# Altium schematic sheet Схема LoRa и RFID Velvet Controller.SchDoc
size A3; SheetNumber: 3; SheetTotal: 6
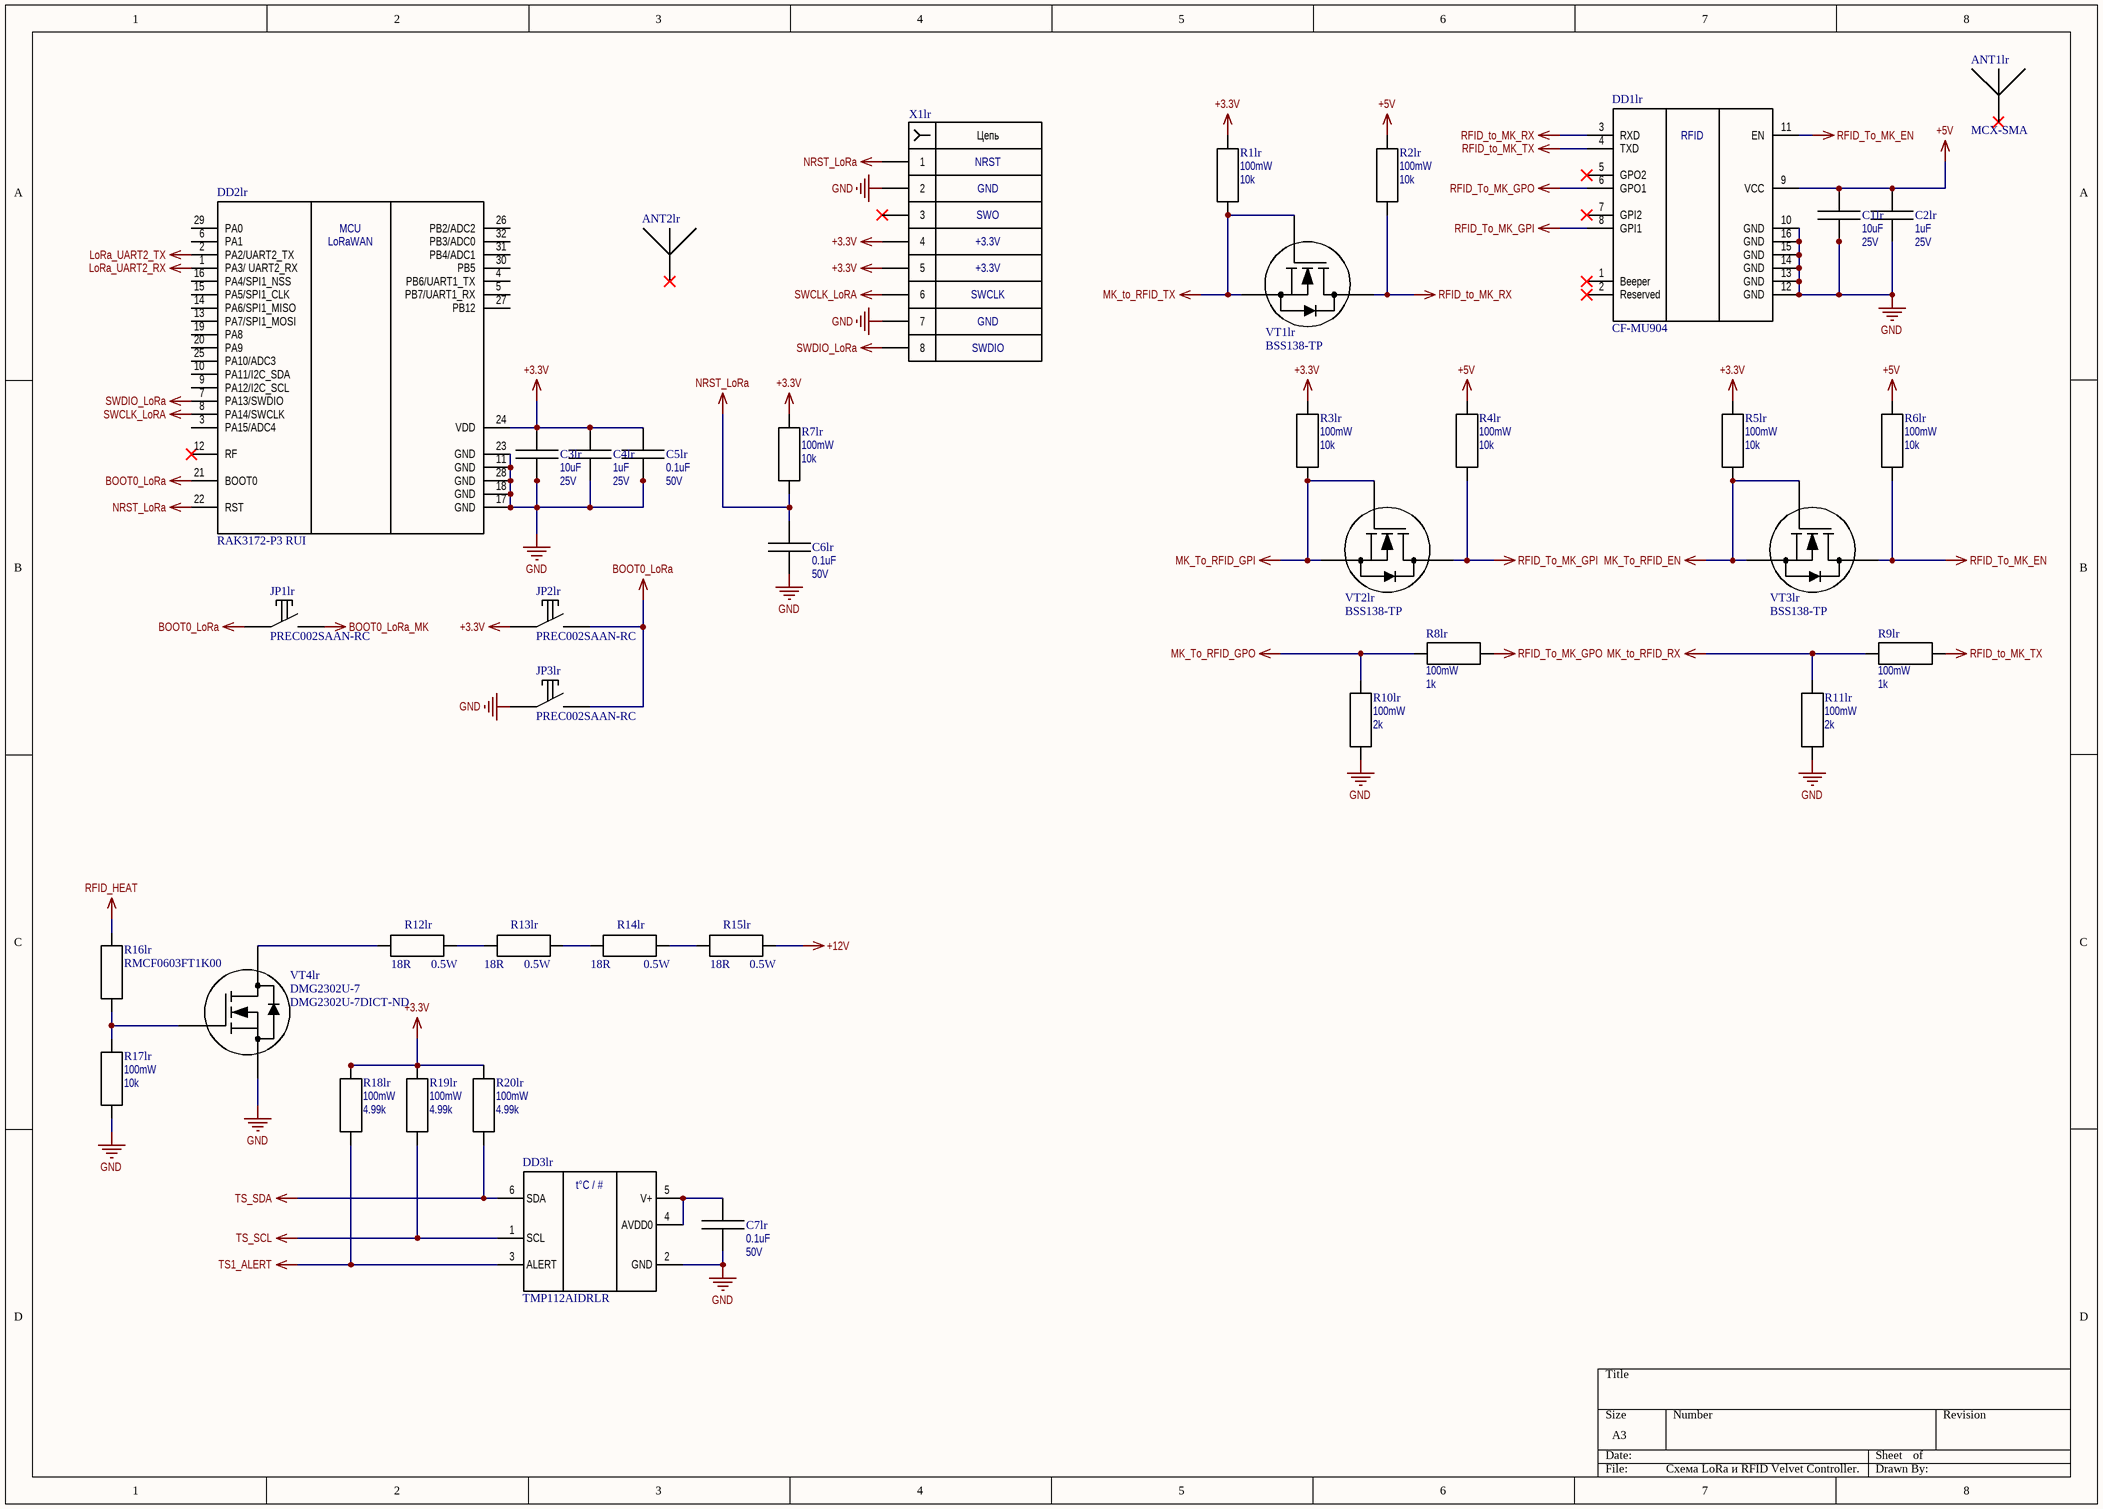
[diagram p0: Схема LoRa и RFID Velvet Controller.SchDoc]

## Parts
ANT1lr  MCX-SMA  (mechanical)
ANT2lr  CA-DKCA0-152L0-AJI0-O  (value not drawn)  (mechanical)
C1lr  Capacitance: 10uF  Rated Voltage: 25V  [CAP 1206 IPC MAX]  (hidden comment: CL31B106KAHNNNE)
C2lr  Capacitance: 1uF  Rated Voltage: 25V  [CAP 0603 IPC MAX]  (hidden comment: TMK107BJ105KA-T)
C3lr  Capacitance: 10uF  Rated Voltage: 25V  [CAP 1206 IPC MAX]  (hidden comment: CL31B106KAHNNNE)
C4lr  Capacitance: 1uF  Rated Voltage: 25V  [CAP 0603 IPC MAX]  (hidden comment: TMK107BJ105KA-T)
C5lr  Capacitance: 0.1uF  Rated Voltage: 50V  [CAP 0603 IPC MAX]  (hidden comment: GCM188R71H104KA57D)
C6lr  Capacitance: 0.1uF  Rated Voltage: 50V  [CAP 0603 IPC MAX]  (hidden comment: GCM188R71H104KA57D)
C7lr  Capacitance: 0.1uF  Rated Voltage: 50V  [CAP 0603 IPC MAX]  (hidden comment: GCM188R71H104KA57D)
DD1lr  CF-MU904  [CF-MU904]
DD2lr  RAK3172-P3 RUI  [RAK3172]
DD3lr  TMP112AIDRLR  [SOT-563]
JP1lr  PREC002SAAN-RC  [2P TH 2.54mm]
JP2lr  PREC002SAAN-RC  [2P TH 2.54mm]
JP3lr  PREC002SAAN-RC  [2P TH 2.54mm]
R1lr  Power Rated: 100mW  Resistance: 10k  [RES 0603 IPC MAX]  (hidden comment: RMCF0603JT10K0)
R2lr  Power Rated: 100mW  Resistance: 10k  [RES 0603 IPC MAX]  (hidden comment: RMCF0603JT10K0)
R3lr  Power Rated: 100mW  Resistance: 10k  [RES 0603 IPC MAX]  (hidden comment: RMCF0603JT10K0)
R4lr  Power Rated: 100mW  Resistance: 10k  [RES 0603 IPC MAX]  (hidden comment: RMCF0603JT10K0)
R5lr  Power Rated: 100mW  Resistance: 10k  [RES 0603 IPC MAX]  (hidden comment: RMCF0603JT10K0)
R6lr  Power Rated: 100mW  Resistance: 10k  [RES 0603 IPC MAX]  (hidden comment: RMCF0603JT10K0)
R7lr  Power Rated: 100mW  Resistance: 10k  [RES 0603 IPC MAX]  (hidden comment: RMCF0603JT10K0)
R8lr  Rated Power: 100mW  Resistance: 1k  [RES 0603 IPC MAX]  (hidden comment: RMCF0603FT1K00)
R9lr  Rated Power: 100mW  Resistance: 1k  [RES 0603 IPC MAX]  (hidden comment: RMCF0603FT1K00)
R10lr  Rated Power: 100mW  Resistance: 2k  [RES 0603 IPC MAX]  (hidden comment: RMCF0603FT2K00)
R11lr  Rated Power: 100mW  Resistance: 2k  [RES 0603 IPC MAX]  (hidden comment: RMCF0603FT2K00)
R12lr  Resistance: 18R  Rated Power: 0.5W  [RES 1210]  (hidden comment: RMCF1210JT18R0)
R13lr  Resistance: 18R  Rated Power: 0.5W  [RES 1210]  (hidden comment: RMCF1210JT18R0)
R14lr  Resistance: 18R  Rated Power: 0.5W  [RES 1210]  (hidden comment: RMCF1210JT18R0)
R15lr  Resistance: 18R  Rated Power: 0.5W  [RES 1210]  (hidden comment: RMCF1210JT18R0)
R16lr  RMCF0603FT1K00  [RES 0603 IPC MAX]
R17lr  Power Rated: 100mW  Resistance: 10k  [RES 0603 IPC MAX]  (hidden comment: RMCF0603JT10K0)
R18lr  Rated Power: 100mW  Resistance: 4.99k  [RES 0603 IPC MAX]  (hidden comment: RC0603FR-074K99L)
R19lr  Rated Power: 100mW  Resistance: 4.99k  [RES 0603 IPC MAX]  (hidden comment: RC0603FR-074K99L)
R20lr  Rated Power: 100mW  Resistance: 4.99k  [RES 0603 IPC MAX]  (hidden comment: RC0603FR-074K99L)
VT1lr  BSS138-TP  [SOT-23-3]
VT2lr  BSS138-TP  [SOT-23-3]
VT3lr  BSS138-TP  [SOT-23-3]
VT4lr  DMG2302U-7  Supplier Part Number 1: DMG2302U-7DICT-ND  [SOT-23-3]
X1lr  TSW-104-07-F-D  [HEADER 2.54mm 2ROW 8PIN]  (value not drawn)

## Nets
+3.3V: C3lr.1 C4lr.1 C5lr.1 DD2lr.24(VDD) JP2lr.1 R1lr.2 R3lr.2 R5lr.2 R7lr.2 R18lr.2 R19lr.2 R20lr.2 X1lr.4 X1lr.5
+5V: C1lr.1 C2lr.1 DD1lr.9(VCC) R2lr.2 R4lr.2 R6lr.2
+12V: R15lr.2
BOOT0_LoRa: DD2lr.21(BOOT0) JP1lr.1 JP2lr.2 JP3lr.2
BOOT0_LoRa_MK: JP1lr.2
GND: C1lr.2 C2lr.2 C3lr.2 C4lr.2 C5lr.2 C6lr.2 C7lr.2 DD1lr.10(GND) DD1lr.12(GND) DD1lr.13(GND) DD1lr.14(GND) DD1lr.15(GND) DD1lr.16(GND) DD2lr.11(GND) DD2lr.17(GND) DD2lr.18(GND) DD2lr.23(GND) DD2lr.28(GND) DD3lr.2(GND) JP3lr.1 R10lr.1 R11lr.1 R17lr.1 VT4lr.2(S) X1lr.2 X1lr.7
LoRa_UART2_RX: DD2lr.1(PA3/_UART2_RX)
LoRa_UART2_TX: DD2lr.2(PA2/UART2_TX)
MK_To_RFID_EN: R5lr.1 VT3lr.1(G) VT3lr.2(S)
MK_To_RFID_GPI: R3lr.1 VT2lr.1(G) VT2lr.2(S)
MK_To_RFID_GPO: R8lr.1 R10lr.2
MK_to_RFID_RX: R9lr.1 R11lr.2
MK_to_RFID_TX: R1lr.1 VT1lr.1(G) VT1lr.2(S)
NRST_LoRa: C6lr.1 DD2lr.22(RST) R7lr.1 X1lr.1
RFID_HEAT: R16lr.2
RFID_To_MK_EN: DD1lr.11(EN) R6lr.1 VT3lr.3(D)
RFID_To_MK_GPI: DD1lr.8(GPI1) R4lr.1 VT2lr.3(D)
RFID_To_MK_GPO: DD1lr.6(GPO1) R8lr.2
RFID_to_MK_RX: DD1lr.3(RXD) R2lr.1 VT1lr.3(D)
RFID_to_MK_TX: DD1lr.4(TXD) R9lr.2
SWCLK_LoRA: DD2lr.8(PA14/SWCLK) X1lr.6
SWDIO_LoRa: DD2lr.7(PA13/SWDIO) X1lr.8
TS1_ALERT: DD3lr.3(ALERT) R18lr.1
TS_SCL: DD3lr.1(SCL) R19lr.1
TS_SDA: DD3lr.6(SDA) R20lr.1
NetC7lr_1: C7lr.1 DD3lr.4(AVDD0) DD3lr.5(V+)
NetR12lr_1: R12lr.1 VT4lr.3(D)
NetR12lr_2: R12lr.2 R13lr.1
NetR13lr_2: R13lr.2 R14lr.1
NetR14lr_2: R14lr.2 R15lr.1
NetR16lr_1: R16lr.1 R17lr.2 VT4lr.1(G)

Not connected (* = marked no-connect by the designer): ANT1lr 1*; ANT2lr 1*; DD1lr 1(Beeper)* 2(Reserved)* 5(GPO2)* 7(GPI2)*; DD2lr 3(PA15/ADC4) 4(PB6/UART1_TX) 5(PB7/UART1_RX) 6(PA1) 9(PA12/I2C_SCL) 10(PA11/I2C_SDA) 12(RF)* 13(PA7/SPI1_MOSI) 14(PA6/SPI1_MISO) 15(PA5/SPI1_CLK) 16(PA4/SPI1_NSS) 19(PA8) 20(PA9) 25(PA10/ADC3) 26(PB2/ADC2) 27(PB12) 29(PA0) 30(PB5) 31(PB4/ADC1) 32(PB3/ADC0); X1lr 3*

## Notes on the sheet
- NRST
- SWO
- GND
- +3.3V
- SWCLK
- SWDIO
- (in symbol CF-MU904) RFID
- (in symbol RAK3172-P3 RUI) MCU
- (in symbol TMP112AIDRLR) t°C / #
- (in symbol TSW-104-07-F-D) Цепь

## Library data of the parts
ANT1lr = MCX-SMA: MCX-Male to SMA RF 15cm connector; Manufacturer 1: DexMRtiC; Style: N-MCX Cable; 1st Contact Gender: Female; 1st Connector Mounting Type: Panel Mount; 2nd Connector: MCX Male Plug Right Angle; 2nd Contact Gender: Male; 2nd Connector Mounting Type: Free Hanging (In-Line); Frequency - Max: 6 GHz; Manufacturer Part Number 1: -; 1st Connector: SMA; Length: 152.00mm; ComponentLink1Description: Aliexpress; ComponentLink1URL: https://aliexpress.ru/item/32231629780.html?algo_pvid=null&algo_expid=null&spm=a2g2w.productlist.search_results.6.4f564aa6TSsm48&sku_id=12000026772307438
ANT2lr = CA-DKCA0-152L0-AJI0-O: WATERPROOF SMA TO IPEX FOR 1.13; Manufacturer 1: Adam Tech; Style: U.FL (UMCC), IPEX MHF1 to SMA; 1st Connector: SMA Jack; 1st Contact Gender: Female; 1st Connector Mounting Type: Panel Mount; 1st Connector Mounting Feature: Bulkhead - Front Side Nut; 2nd Connector: U.FL (UMCC), IPEX MHF1 Plug, Right Angle; 2nd Connector Mounting Type: Free Hanging (In-Line); Frequency - Max: 6 GHz; Manufacturer Part Number 1: CA-DKCA0-152L0-AJI0-O; 2nd Contact Gender: Female; 2nd Connector Mounting Feature: *; Length: 152.00mm
C1lr C3lr = CL31B106KAHNNNE: CAP SMD CER 10UF 25V X7R 1206; Manufacturer 1: Samsung Electro-Mechanics; Tolerance: 10%; Type: Multilayer Ceramic; Manufacturer Part Number 1: CL31B106KAHNNNE; Min Operating Temperature: -55°C; Max Operating Temperature: 125°C; Mounting: SM; Package: 1206; Supplier 1: Digi-Key; Supplier Part Number 1: 1276-1804-1-ND
C2lr C4lr = TMK107BJ105KA-T: CAP SMD CER 1UF 25V X5R 0603; Manufacturer 1: Taiyo Yuden; Tolerance: 10%; Type: Multilayer Ceramic; Manufacturer Part Number 1: TMK107BJ105KA-T; Min Operating Temperature: -55°C; Max Operating Temperature: 85°C; Mounting: SM; Package: 0603; Supplier 1: Digi-Key; Supplier Part Number 1: 587-1248-1-ND
C5lr C6lr C7lr = GCM188R71H104KA57D: CAP SMD CER 0.1UF 50V X7R 0603; Manufacturer 1: Murata Electronics; Tolerance: 10%; Type: Multilayer Ceramic; Manufacturer Part Number 1: GCM188R71H104KA57D; Min Operating Temperature: -55°C; Max Operating Temperature: 125°C; Mounting: SM; Package: 0603; Supplier 1: Digi-Key; Supplier Part Number 1: 490-4779-1-ND
DD1lr = CF-MU904: UHF RFID Reader Module; Manufacturer 1: ChaFon; Frequency Band 1: 902~928MHz; Frequency Band 2: 865~868MHz; Effective Range: 15m; Tag Buffer Size 1: 370PCS@Max.128bitsEPC; Tag Buffer Size 2: 120PCS@Max.496bitsEPC; Min Supply Voltage: 3.5V; Max Supply Voltage: 5V; RSSI: Yes; Interface: UART; Max Supply Current: 360mA; Manufacturer Part Number 1: CF-MU904; Package: *
DD2lr = RAK3172-P3 RUI: MODULE FOR LORAWAN RAK3172; Manufacturer 1: RAKwireless Technology Limited; Function: Transceiver; Frequency: 433MHz, 470MHz, 864MHz, 865MHz, 868MHz, 915MHz, 920MHz, 923MHz; Min Supply Voltage: 2V; Max Supply Voltage: 3.6V; Max Supply Current: 100mA; Manufacturer Part Number 1: RAK3172-P3 RUI; Min Operating Temperature: -40°C; Max Operating Temperature: 85°C; RF Type: LoRaWAN; Package: 32-SMD Module
DD3lr = TMP112AIDRLR: SOT-563 TEMPERATURE SENSORS ROHS; Manufacturer 1: UMW; Max Accuracy: ±0.1°C; Min Accuracy: ±1°C; Resolution: 12b; Interface: I²C/SMBus; Manufacturer Part Number 1: TMP112AIDRLR; Max Operating Temperature: 150°C; Min Operating Temperature: -55°C; Mounting Type: SM; Package: SOT-563; Supplier 1: Digi-Key; Supplier Part Number 1: 296-38578-1-ND
JP1lr JP2lr JP3lr = PREC002SAAN-RC: CONN HEADER VERT 2POS 2.54MM; Manufacturer 1: Sullins Connector Solutions; Manufacturer Part Number 1: PREC002SAAN-RC; Number of Pins: 2; Pitch: 2.54mm
R1lr R2lr R3lr R4lr R5lr R6lr R7lr R17lr = RMCF0603JT10K0: RES SMD 10K OHM 5% 1/10W 0603; Manufacturer 1: Stackpole Electronics Inc; Voltage Rated: 75V; Manufacturer Part Number 1: RMCF0603JT10K0; Min Operating Temperature: -55°C; Max Operating Temperature: 155°C; Tolerance: 5%; Package: 0603; Ratings: AEC-Q200; Supplier 1: Digi-Key; Supplier Part Number 1: RMCF0603JT10K0CT-ND
R8lr R9lr = RMCF0603FT1K00: RES SMD 1K OHM 1% 1/10W 0603; Manufacturer 1: Stackpole Electronics Inc; Rated Voltage: 75V; Qualification: AEC-Q200; Manufacturer Part Number 1: RMCF0603FT1K00; Tolerance: 1%; Package: 0603; Min Operating Temperature: -55°C; Max Operating Temperature: 155°C
R10lr R11lr = RMCF0603FT2K00: RES SMD 2K OHM 1% 1/10W 0603; Manufacturer 1: Stackpole Electronics Inc; Rated Voltage: 75V; Qualification: AEC-Q200; Manufacturer Part Number 1: RMCF0603FT2K00; Tolerance: 1%; Package: 0603; Min Operating Temperature: -55°C; Max Operating Temperature: 155°C
R12lr R13lr R14lr R15lr = RMCF1210JT18R0: RES SMD 18 OHM 5% 1/2W 1210; Manufacturer 1: Stackpole Electronics Inc; Rated Voltage: 200V; Qualification: AEC-Q200; Manufacturer Part Number 1: RMCF1210JT18R0; Tolerance: 5%; Package: 1210; Min Operating Temperature: -55°C; Max Operating Temperature: 155°C
R16lr = RMCF0603FT1K00: RES SMD 1K OHM 1% 1/10W 0603; Manufacturer 1: Stackpole Electronics Inc; Rated Voltage: 75V; Rated Power: 100mW; Qualification: AEC-Q200; Manufacturer Part Number 1: RMCF0603FT1K00; Resistance: 1k; Tolerance: 1%; Package: 0603; Min Operating Temperature: -55°C; Max Operating Temperature: 155°C
R18lr R19lr R20lr = RC0603FR-074K99L: RES SMD 4.99K OHM 1% 1/10W 0603; Manufacturer 1: YAGEO; Rated Voltage: 75V; Manufacturer Part Number 1: RC0603FR-074K99L; Tolerance: 1%; Package: 0603; Min Operating Temperature: -55°C; Max Operating Temperature: 155°C; Qualification: -
VT1lr VT2lr VT3lr = BSS138-TP: MOSFET N-CH 50V 220MA SOT23; Manufacturer 1: Micro Commercial Co; Type: P-Chanel; Rds On (Max): 3.5Ohm; Vth: 1.5V; Gate Charge: 1.65nC; Vgs Max: 20V; Input Capacitance: 60pF; Max Power Dissipation: 350mW; Vds Max: 50V; Max Drain Current: 220mA; Min Operating Temperature: -55°C; Max Operating Temperature: 150°C; Mounting Type: SM; Package: SOT-23; Manufacturer Part Number 1: BSS138-TP; Supplier 1: Digi-Key; Supplier Part Number 1: BSS138-TPMSCT-ND
VT4lr = DMG2302U-7: MOSFET N-CH 20V 4.2A SOT23-3; Manufacturer 1: Diodes Incorporated; Type: P-Chanel; Rds On (Max): 90mOhm; Vth: 1V; Gate Charge: 7nC; Vgs Max: 8V; Input Capacitance: 594pF; Max Power Dissipation: 800mW; Vds Max: 20V; Max Drain Current: 4.2A; Min Operating Temperature: -55°C; Max Operating Temperature: 150°C; Mounting Type: SM; Package: SOT-23-3; Manufacturer Part Number 1: DMG2302U-7; Supplier 1: Digi-Key
X1lr = TSW-104-07-F-D: CONN HEADER VERT 8POS 2.54MM 2ROWx4; Manufacturer 1: Samtec Inc.; Rated Voltage: 400V; Rated Current: 2A; Contact Length - Mating: 5.84mm; Overall Contact Length: 10.92mm; Min Operating Temperatire: -55℃; Max Operating Temperature: 125℃; Contact Length - Post: 2.54mm; Insulation Height: 2.54mm; Manufacturer Part Number 1: TSW-104-07-F-D; Pitch: 2.54mm; Supplier 1: Digi-Key; Supplier Part Number 1: SAM8996-ND